# EAGLE design Platine_Messgeraet_Frank_20220825-v003 (EAGLE 9.6.2)
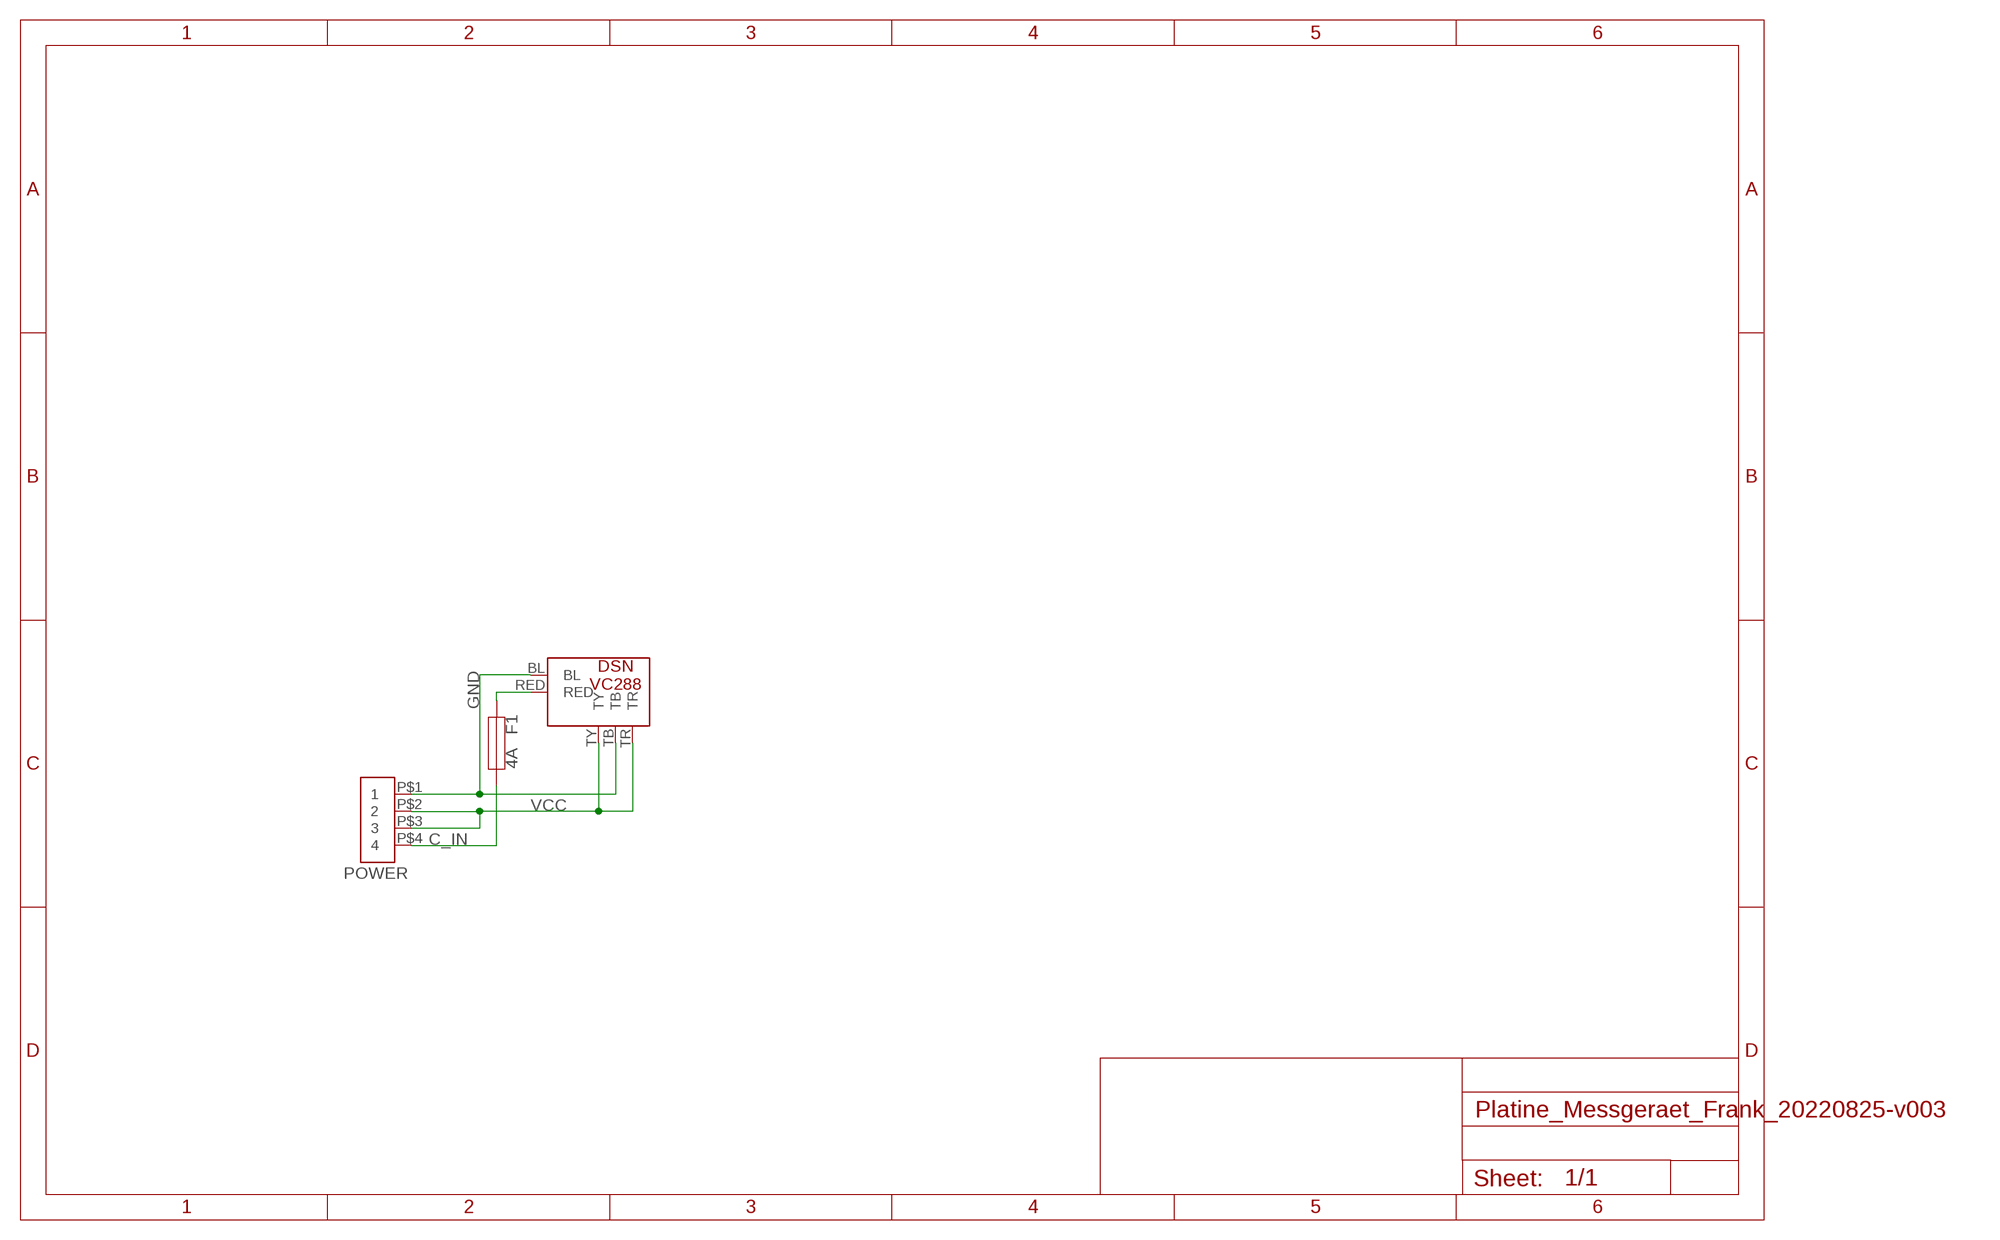
[diagram p0: schematic, sheet 1]

## Parts
F1  4A  FUSES90  [FUSE_5X20-L]
POWER  CB-SCREW-4P0°  [CTB932VD-4]
U$1  DSN-VC288  [DSN-VC288]

## Nets
C_IN: F1.1 POWER.P$4
GND: POWER.P$1 U$1.BL U$1.TB
N$1: F1.2 U$1.RED
VCC: POWER.P$2 POWER.P$3 U$1.TR U$1.TY

## Library data of the parts
F1 = HD_Passive:FUSES
POWER = HD_Kontakte:CB-SCREW-4P
U$1 = HD_Platinen:DSN-VC288

## Board
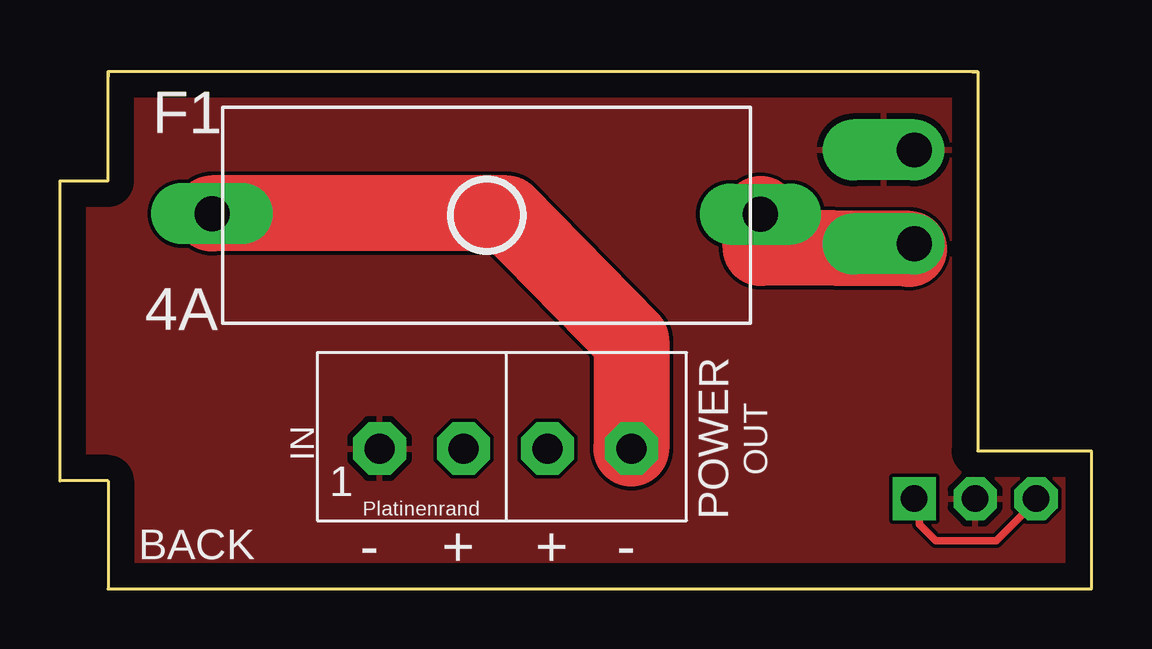
[diagram p1: board, top side]
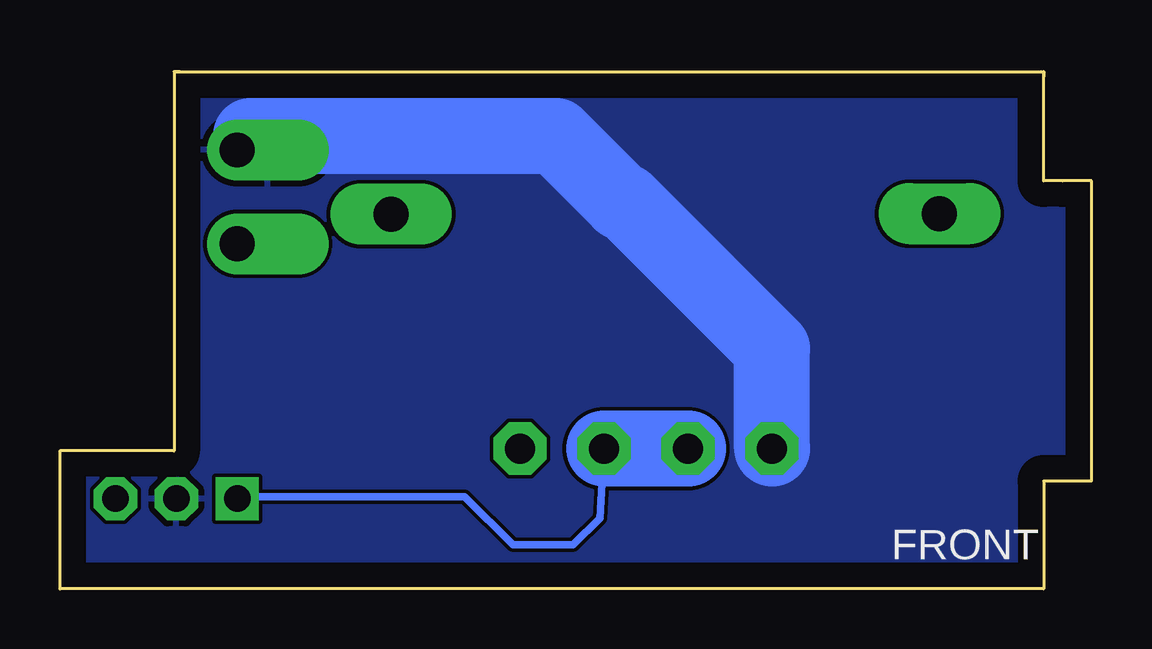
[diagram p2: board, bottom side, seen from below]

Size 43 x 21.55 mm. Coordinates in mm from the lower left corner, seen from the top.
Outline: 2.1,21.55 2,21.55 2,21.35
Copper layers (1*16): Top 0.035mm / dielectric 1.5mm / Bottom 0.035mm
Design rules "default *": minimum track width 12mil, minimum drill 0.35mm, track to track 6mil, track to pad 6mil, pad to pad 6mil, via to via 6mil, smd to smd 6mil, copper to edge 40mil, drill to drill 6mil, minimum pad ring 10mil, minimum via ring 8mil, stop-mask expansion 4mil, vias tented up to drill 0mil, thermal gap 10mil

### Footprints (pad centres in the part's own frame; a part is rotated, then mirrored left to right if it is on the bottom)
FUSE_5X20-L = drill 1.45 pad 2.54 long: 1 -11.502,0; 2 11.358,-0.021
CTB932VD-4 = drill 1.25 pad 2.2 octagon: P$1 2.6,3; P$2 6.1,3; P$3 9.6,3; P$4 13.1,3
DSN-VC288 = drill 1.45 pad 2.54 offset: BL 33.61,18.34; RED 33.61,14.43 | drill 1.1 pad 1.8 octagon: TB 36.15,3.81; TR 38.69,3.81 | drill 1.1 pad 1.8 square: TY 33.61,3.81

### Placement (x,y rotation side)
F1  17.84,15.64 0 top
POWER  10.72,2.85 0 top
U$1  2,-0.05 0 top

### Tracks (layer width: path | path; a pad name or v marks a point on that pad's centre or on a via)
C_IN
  Top 3.175: F1.1 18.62,15.65 23.82,10.34 POWER.P$4
GND
  Bottom 2.54: 35.04,18.86 U$1.BL
  Bottom 3.175: POWER.P$1 13.32,10 19.45,16.13 19.59,16.13 22.33,18.86 35.04,18.86
  pour Top: 2.1,4.55 0.2,4.55 0.2,16.85 2.1,16.85 2.1,21.35 2.3,21.35 38,21.35 38,5.55 42.8,5.55 42.8,0.15 2.1,0.15
  pour Bottom: 2.1,4.65 1.5,4.65 0.1,4.65 0.1,16.95 2,16.95 2,21.35 2.2,21.35 38,21.35 38,21.25 38,5.55 38.1,5.55 42.8,5.55 42.8,0.25 2.1,0.25
N$1
  Top 2.54: 35.4,14.17 U$1.RED
  Top 3.175: 35.4,14.17 29.2,14.21 F1.2
VCC
  Top 0.305: U$1.TY 35.83,3.61 35.83,2.69 36.52,2.01 39.03,2.01 40.63,3.61 U$1.TR
  Bottom 0.305: U$1.TY 35.6,3.84 26.13,3.84 24.12,1.83 21.61,1.83 20.5,2.94 POWER.P$3
  Bottom 3.175: POWER.P$2 POWER.P$3

### Text on the board
tPlace: IN | OUT | - | + | + | -
tDocu: 2022-08-26 | Ver.: 1.00
bDocu: VI-Messgeraet-Anschlussplatine | Idee: Frank - Design: Dominik | 2022-08-26 | Version: 1.00